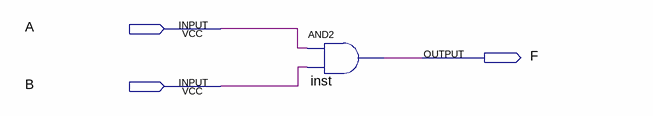
[diagram p0: schematic sheet]
// Quartus schematic and-2.bdf as structural Verilog: 1 symbols, 3 pins
module \and-2  (
  input  A,
  input  B,
  output F
);

  and inst (F, A, B);
endmodule
